# EAGLE schematic s2 (EAGLE 7.5.0)
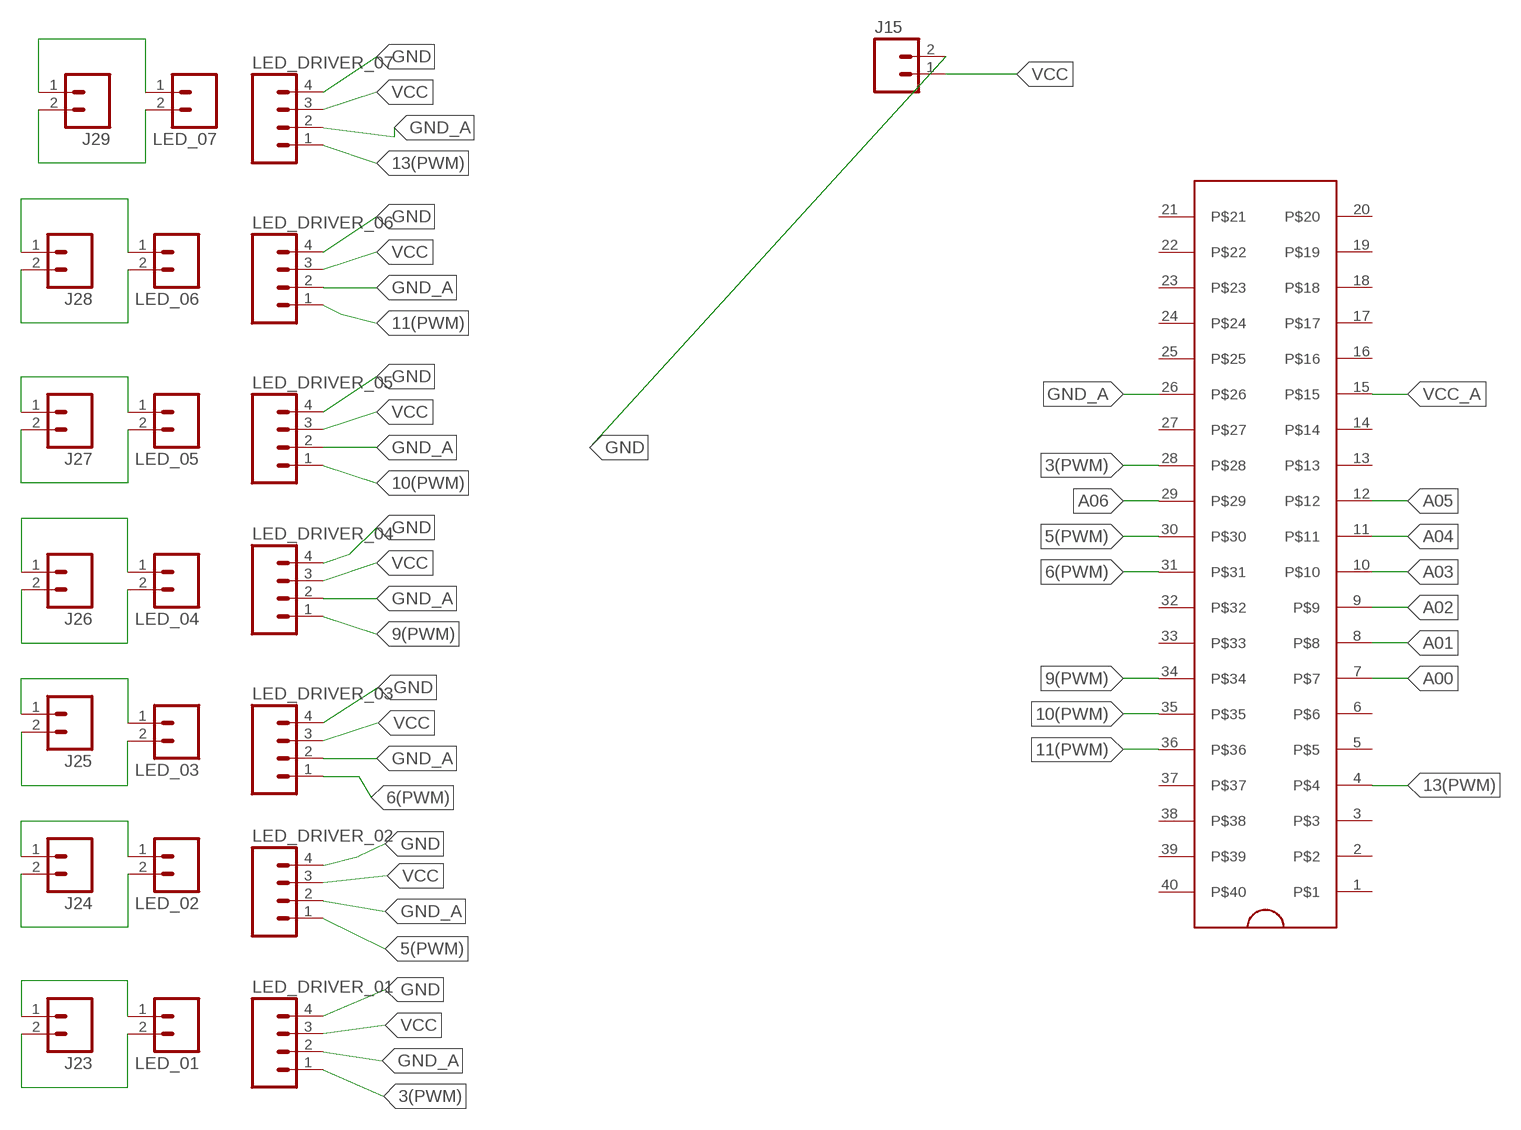
[diagram p0: schematic, sheet 1]

## Parts
ARDUINO_MICRO  ZIFSOCKET-40-6DIL40-6-ZIF_SOCKET  [DIL40-6-ZIF_SOCKET]
J15  M02PTH  [1X02]
J23  M02PTH  [1X02]
J24  M02PTH  [1X02]
J25  M02PTH  [1X02]
J26  M02PTH  [1X02]
J27  M02PTH  [1X02]
J28  M02PTH  [1X02]
J29  M02PTH  [1X02]
LED_01  M02PTH  [1X02]
LED_02  M02PTH  [1X02]
LED_03  M02PTH  [1X02]
LED_04  M02PTH  [1X02]
LED_05  M02PTH  [1X02]
LED_06  M02PTH  [1X02]
LED_07  M02PTH  [1X02]
LED_DRIVER_01  M04PTH  [1X04]
LED_DRIVER_02  M04PTH  [1X04]
LED_DRIVER_03  M04PTH  [1X04]
LED_DRIVER_04  M04PTH  [1X04]
LED_DRIVER_05  M04PTH  [1X04]
LED_DRIVER_06  M04PTH  [1X04]
LED_DRIVER_07  M04PTH  [1X04]

## Nets
3(PWM): ARDUINO_MICRO.28 LED_DRIVER_01.1
5(PWM): ARDUINO_MICRO.30 LED_DRIVER_02.1
6(PWM): ARDUINO_MICRO.31 LED_DRIVER_03.1
9(PWM): ARDUINO_MICRO.34 LED_DRIVER_04.1
10(PWM): ARDUINO_MICRO.35 LED_DRIVER_05.1
11(PWM): ARDUINO_MICRO.36 LED_DRIVER_06.1
13(PWM): ARDUINO_MICRO.4 LED_DRIVER_07.1
A00: ARDUINO_MICRO.7
A01: ARDUINO_MICRO.8
A02: ARDUINO_MICRO.9
A03: ARDUINO_MICRO.10
A04: ARDUINO_MICRO.11
A05: ARDUINO_MICRO.12
A06: ARDUINO_MICRO.29
GND: J15.2 LED_DRIVER_01.4 LED_DRIVER_02.4 LED_DRIVER_03.4 LED_DRIVER_04.4 LED_DRIVER_05.4 LED_DRIVER_06.4 LED_DRIVER_07.4
GND_A: ARDUINO_MICRO.26 LED_DRIVER_01.2 LED_DRIVER_02.2 LED_DRIVER_03.2 LED_DRIVER_04.2 LED_DRIVER_05.2 LED_DRIVER_06.2 LED_DRIVER_07.2
N$1: J23.1 LED_01.1
N$2: J23.2 LED_01.2
N$3: J24.2 LED_02.2
N$4: J24.1 LED_02.1
N$5: J25.2 LED_03.2
N$6: J25.1 LED_03.1
N$7: J26.2 LED_04.2
N$8: J26.1 LED_04.1
N$9: J27.2 LED_05.2
N$10: J27.1 LED_05.1
N$11: J28.2 LED_06.2
N$12: J28.1 LED_06.1
N$13: J29.2 LED_07.2
N$14: J29.1 LED_07.1
VCC: J15.1 LED_DRIVER_01.3 LED_DRIVER_02.3 LED_DRIVER_03.3 LED_DRIVER_04.3 LED_DRIVER_05.3 LED_DRIVER_06.3 LED_DRIVER_07.3
VCC_A: ARDUINO_MICRO.15
Unconnected: ARDUINO_MICRO.1 ARDUINO_MICRO.2 ARDUINO_MICRO.3 ARDUINO_MICRO.5 ARDUINO_MICRO.6 ARDUINO_MICRO.13 ARDUINO_MICRO.14 ARDUINO_MICRO.16 ARDUINO_MICRO.17 ARDUINO_MICRO.18 ARDUINO_MICRO.19 ARDUINO_MICRO.20 ARDUINO_MICRO.21 ARDUINO_MICRO.22 ARDUINO_MICRO.23 ARDUINO_MICRO.24 ARDUINO_MICRO.25 ARDUINO_MICRO.27 ARDUINO_MICRO.32 ARDUINO_MICRO.33 ARDUINO_MICRO.37 ARDUINO_MICRO.38 ARDUINO_MICRO.39 ARDUINO_MICRO.40

## Library data of the parts
ARDUINO_MICRO = SparkFun-Connectors:ZIFSOCKET-40-6: Lever-action ZIF socket for 40-pin ICs
J15 J23-J29 LED_01-LED_07 = SparkFun-Connectors:M02: Standard 2-pin 0.1" header. Use with - straight break away headers ( PRT-00116) - right angle break away headers (PRT-00553) - swiss pins (PRT-00743) - machine pins (PRT-00117) - female headers (PRT-00115) Molex polarized connector foot print use with: PRT-08233 with associated crimp pins and housings. 2.54_SCREWTERM for use with PRT-10571. 3.5mm Screw Terminal footprints for PRT-08084 5mm Screw Terminal footprints for use with PRT-08432
LED_DRIVER_01-LED_DRIVER_07 = SparkFun-Connectors:M04: Header 4 Standard 4-pin 0.1" header. Use with straight break away headers (SKU : PRT-00116), right angle break away headers (PRT-00553), swiss pins (PRT-00743), machine pins (PRT-00117), and female headers (PRT-00115). Molex polarized connector foot print use with SKU : PRT-08231 with associated crimp pins and housings. 1MM SMD Version SKU: PRT-10208; PROD_ID: CONN-09696

## Net classes
0 default: clearance 0.205 mm